# EasyEDA schematic 1-Schematic_NAKUJA REMIX.json
TITLE: Sheet_1; REV: 1.0; Date: 2022-04-21; Sheet: 1/1; Company: Your Company
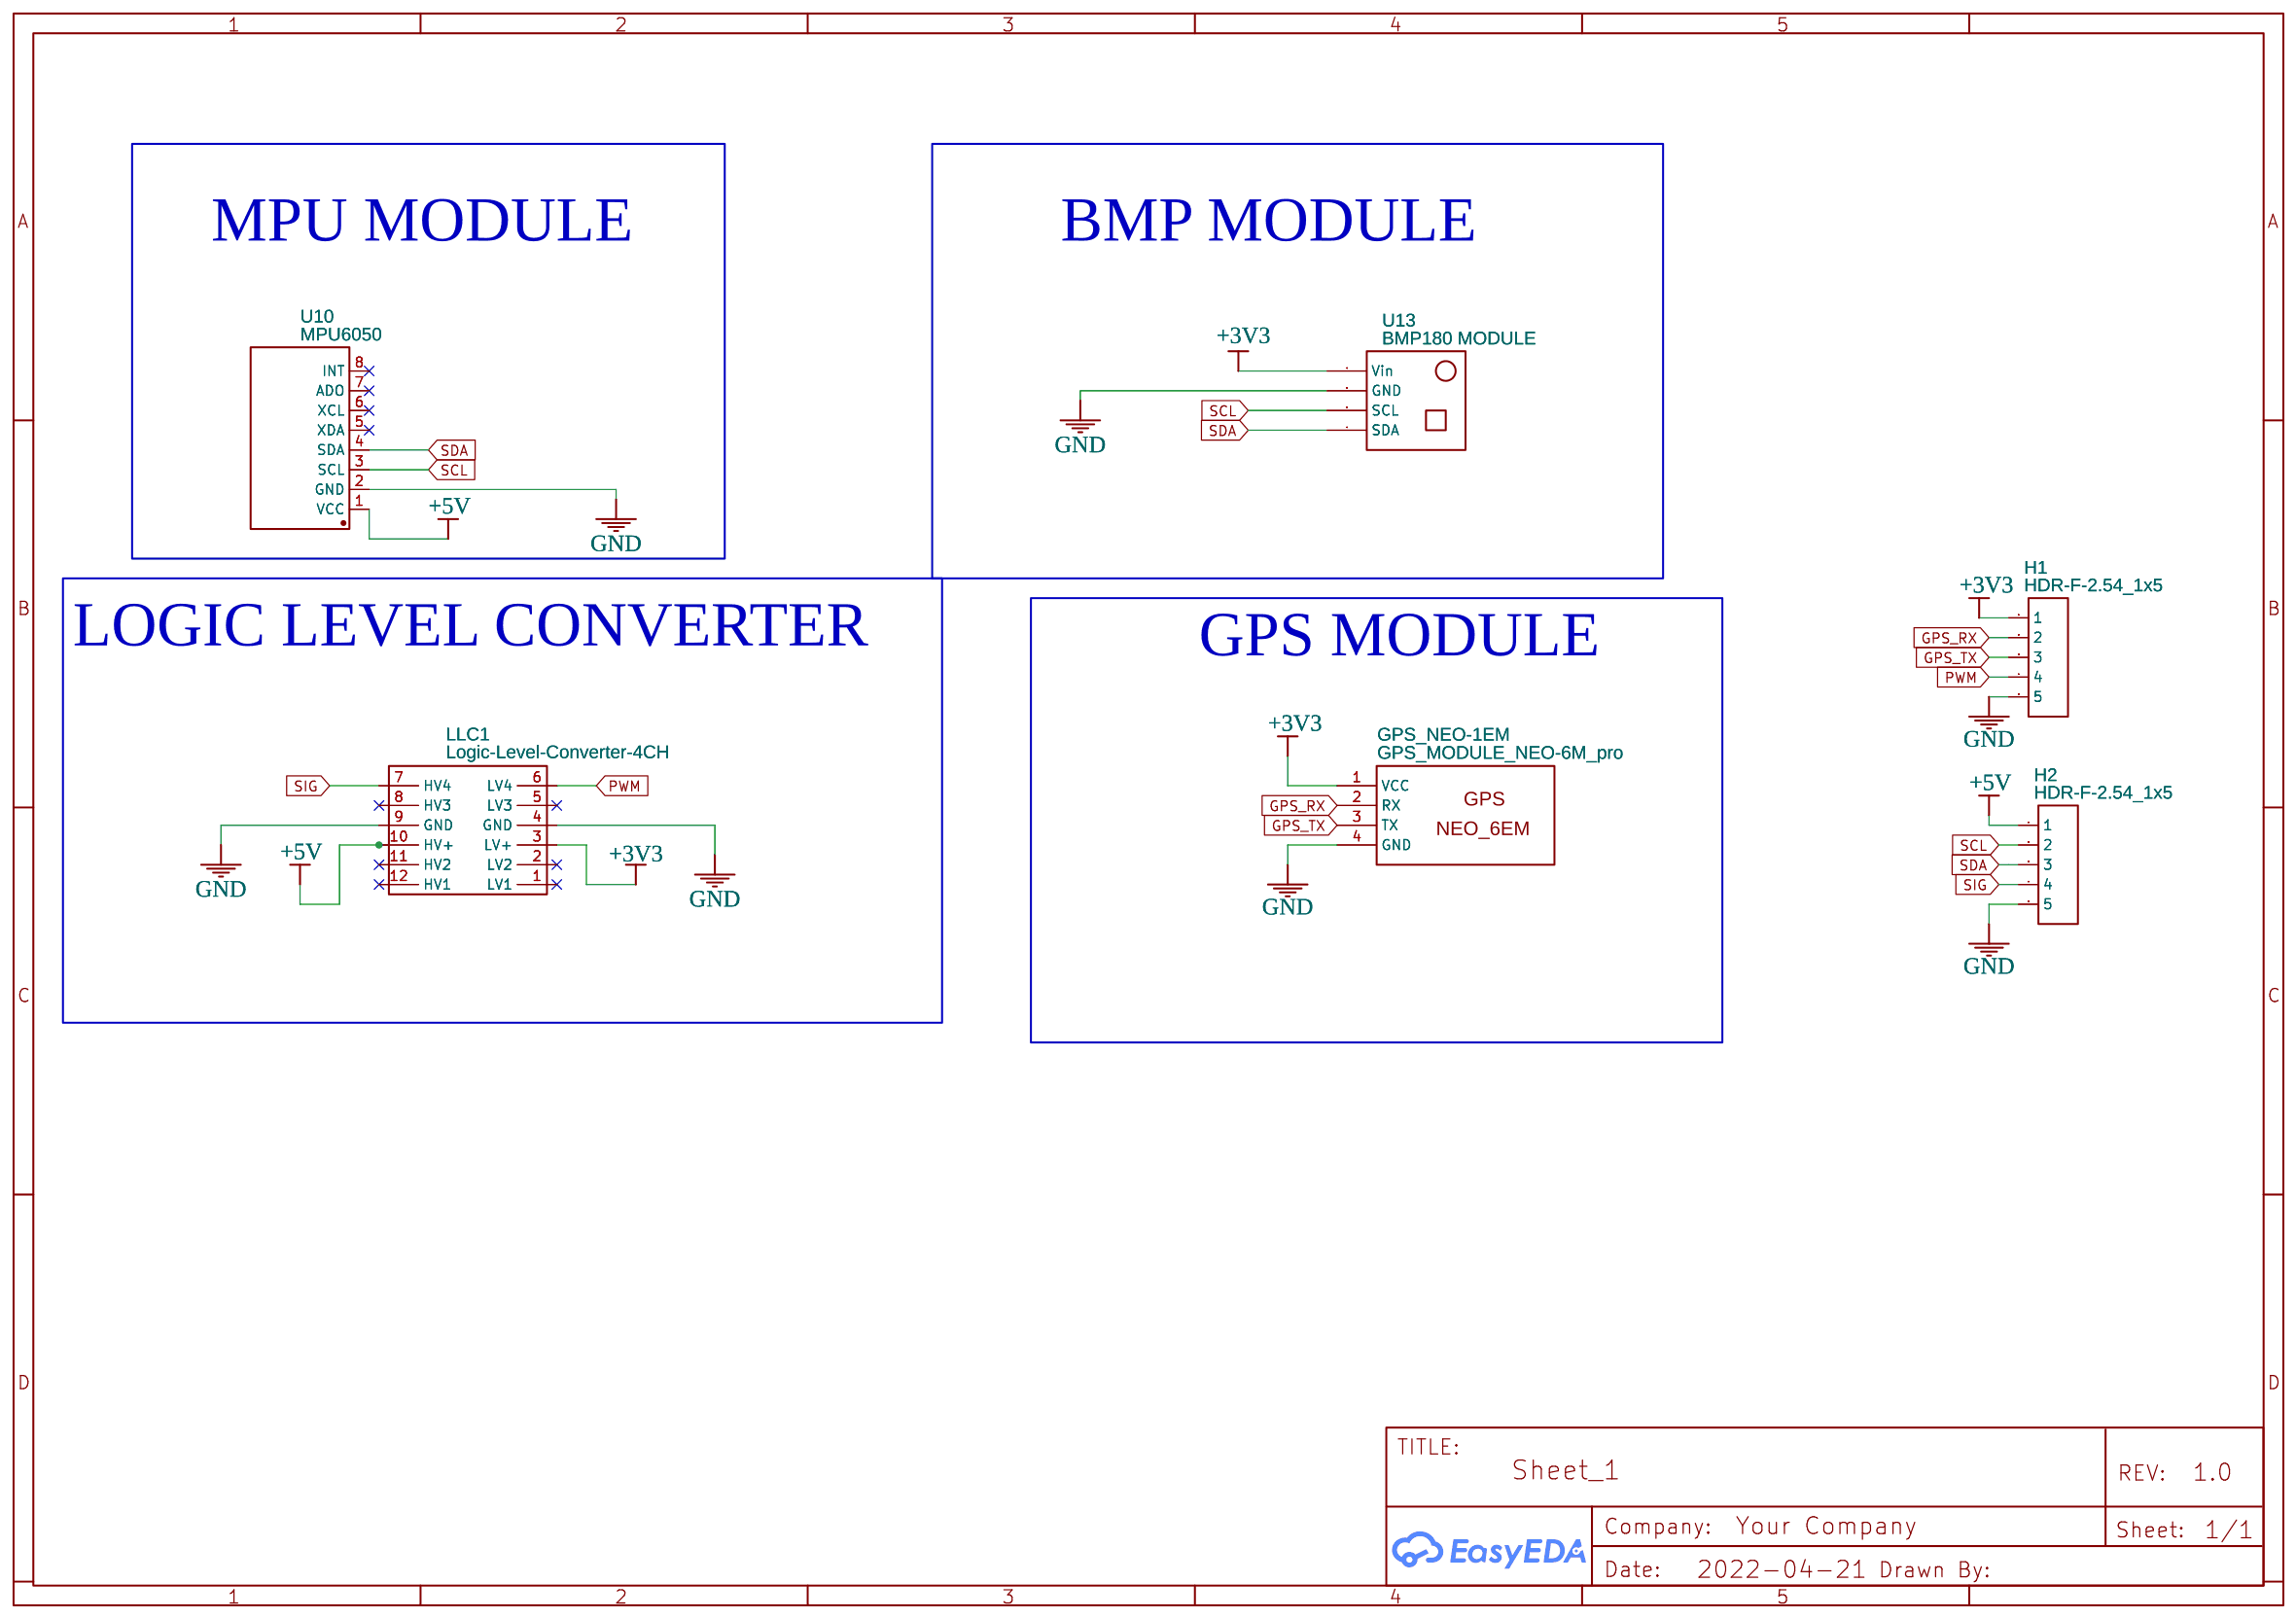
[diagram p0: schematic sheet]

## Parts
GPS_NEO-1EM  GPS_MODULE_NEO-6M_pro  [GPS_MODULE]
H1  HDR-F-2.54_1x5  [HDR-F-2.54_1X5]
H2  HDR-F-2.54_1x5  [HDR-F-2.54_1X5]
LLC1  Logic-Level-Converter-4CH  [LOGIC-LEVEL-CONVERTER-4CH]
U10  MPU6050  [MPU6050]
U13  BMP180 MODULE  [BMP180 MODULE (HW-596)]

## Library data of the parts
GPS_NEO-1EM = GPS_MODULE_NEO-6M_pro: Contributor: Sanchezz2; sourceId: cy4mEWdvN
H1 H2 = HDR-F-2.54_1x5: Supplier Part: C50950; Supplier: LCSC; Contributor: LCEDA_Lib
LLC1 = Logic-Level-Converter-4CH: Supplier Part: 50807; Supplier: Космодром; Contributor: Олег Мошник
U10 = MPU6050: Supplier Part: GY521; Contributor: rahulaggarwal
U13 = BMP180 MODULE: Manufacturer Part: BMP180 (HW-596); Contributor: esguti

## Nets
+3V3: GPS_NEO-1EM.1(VCC) H1.1 LLC1.3(LV+) U13.1(Vin)
+5V: H2.1 LLC1.10(HV+) U10.1(VCC)
GND: GPS_NEO-1EM.4(GND) H1.5 H2.5 LLC1.4(GND) LLC1.9(GND) U10.2(GND) U13.2(GND)
GPS_RX: GPS_NEO-1EM.2(RX) H1.2
GPS_TX: GPS_NEO-1EM.3(TX) H1.3
PWM: H1.4 LLC1.6(LV4)
SCL: H2.2 U10.3(SCL) U13.3(SCL)
SDA: H2.3 U10.4(SDA) U13.4(SDA)
SIG: H2.4 LLC1.7(HV4)

Not connected (* = marked no-connect by the designer): LLC1 1(LV1)* 2(LV2)* 5(LV3)* 8(HV3)* 11(HV2)* 12(HV1)*; U10 5(XDA)* 6(XCL)* 7(ADO)* 8(INT)*

## Notes on the sheet
- MPU MODULE
- BMP MODULE
- LOGIC LEVEL CONVERTER
- GPS MODULE
